# Altium schematic sheet Antialiasing Filter.SchDoc: Anti-aliasing Filter
size OrCAD A
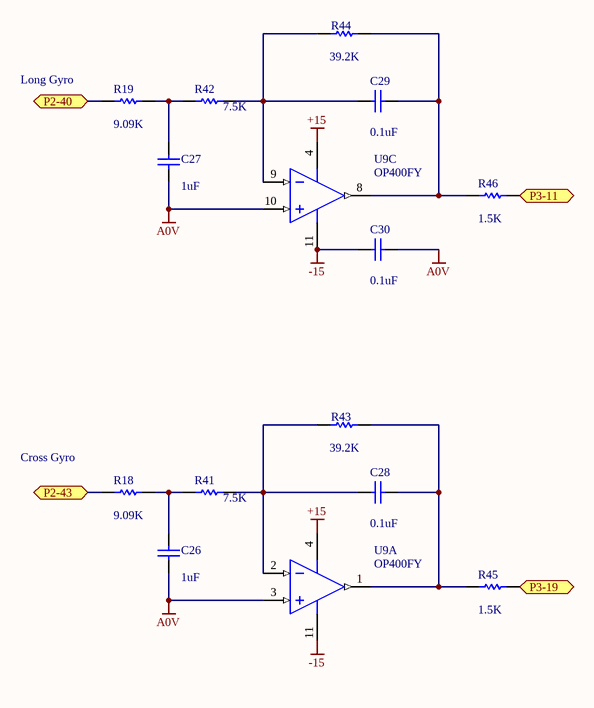
[diagram p0: Antialiasing Filter.SchDoc]

## Parts
C26  value 1uF  [RAD-0.3]  (hidden comment: Cap)
C27  value 1uF  [RAD-0.3]  (hidden comment: Cap)
C28  value 0.1uF  [RAD-0.3]  (hidden comment: Cap)
C29  value 0.1uF  [RAD-0.3]  (hidden comment: Cap)
C30  value 0.1uF  [RAD-0.3]  (hidden comment: Cap)
R18  value 9.09K  [AXIAL-0.3]  (hidden comment: Res1)
R19  value 9.09K  [AXIAL-0.3]  (hidden comment: Res1)
R41  value 7.5K  [AXIAL-0.3]  (hidden comment: Res1)
R42  value 7.5K  [AXIAL-0.3]  (hidden comment: Res1)
R43  value 39.2K  [AXIAL-0.3]  (hidden comment: Res1)
R44  value 39.2K  [AXIAL-0.3]  (hidden comment: Res1)
R45  value 1.5K  [AXIAL-0.3]  (hidden comment: Res1)
R46  value 1.5K  [AXIAL-0.3]  (hidden comment: Res1)
U9  OP400FY  [ADI-Q-14]  (parts A,C of 4)

## Ports
P2-40, P2-43, P3-11, P3-19

## Nets
+15: U9.4(+V)
-15: C30.1 U9.11(-V)
A0V: C26.2 C27.2 C30.2 U9.3(+IN_A) U9.10(+IN_C)
P2-40: R19.1 ; port P2-40
P2-43: R18.1 ; port P2-43
P3-11: R46.2 ; port P3-11
P3-19: R45.2 ; port P3-19
NetC26_1: C26.1 R18.2 R41.1
NetC27_1: C27.1 R19.2 R42.1
NetC28_1: C28.1 R41.2 R43.1 U9.2(-IN_A)
NetC28_2: C28.2 R43.2 R45.1 U9.1(OUT_A)
NetC29_1: C29.1 R42.2 R44.1 U9.9(-IN_C)
NetC29_2: C29.2 R44.2 R46.1 U9.8(OUT_C)

## Notes on the sheet
- (near R19) Long Gyro
- (near R18) Cross Gyro
- Title
- Size:
- Date:
- Orcad A
- Number:
- Time:
- Revision:
- Sheet
- of
- ZLS Corporation
- 7801 North Lamar Blvd.
- Suite E-184
- Austin, Texas 78752  USA
- (512) 453-0288
- File:

## Library data of the parts
C26-C30 = Cap: Capacitor; Published: 8-Jun-2000; LatestRevisionDate: 17-Jul-2002; LatestRevisionNote: Re-released for DXP Platform.; PackageReference: RAD-0.3; Publisher: Altium Limited; PackageDescription: Radial Cap, Thru-Hole; 2 Leads; 0.3 in Pin Spacing
R18 R19 R41-R46 = Res1: Resistor; Published: 8-Jun-2000; LatestRevisionDate: 17-Jul-2002; LatestRevisionNote: Re-released for DXP Platform.; PackageReference: AXIAL-0.3; Publisher: Altium Limited; PackageDescription: Axial Device, Thru-Hole; 2 Leads; 0.3 in Pin Spacing
U9 = CMP-0384-00277-1: Quad Channel Low Supply Current Operational Amplifier, 500 KHz BW, 150 mV/us SR, Industrial, 14-pin DIP (Q-14), Tube; Manufacturer: Analog Devices; Generic Part Number: OP400; Small Signal Bandwidth: 500KHz; Input Bias Current: 750pA; Input Offset Voltage: 80uV; Iq/Amp: 725uA; V Span Max: 40V; Amplifiers Per Package: 4; V Span Min: 6V; Packing: Tube; Mounting Technology: Through Hole; ComponentLink3Description: Package Specification; Slew Rate: 150mV/us; ComponentLink2Description: Datasheet; ComponentLink1Description: Manufacturer URL; ComponentLink1URL: http://www.analog.com/en/index.html; PackageDescription: 14-Pin Ceramic Dual In-Line Package, Row spacing 7.62 mm, Pitch 2.54 mm; ComponentLink2URL: http://www.analog.com/static/imported-files/data_sheets/OP400.pdf; DatasheetVersion: Rev. G; PackageReference: Q-14; PartNumber: OP400FY; ComponentLink3URL: http://www.analog.com/static/imported-files/packages/393665681442905251546090Q_14.pdf